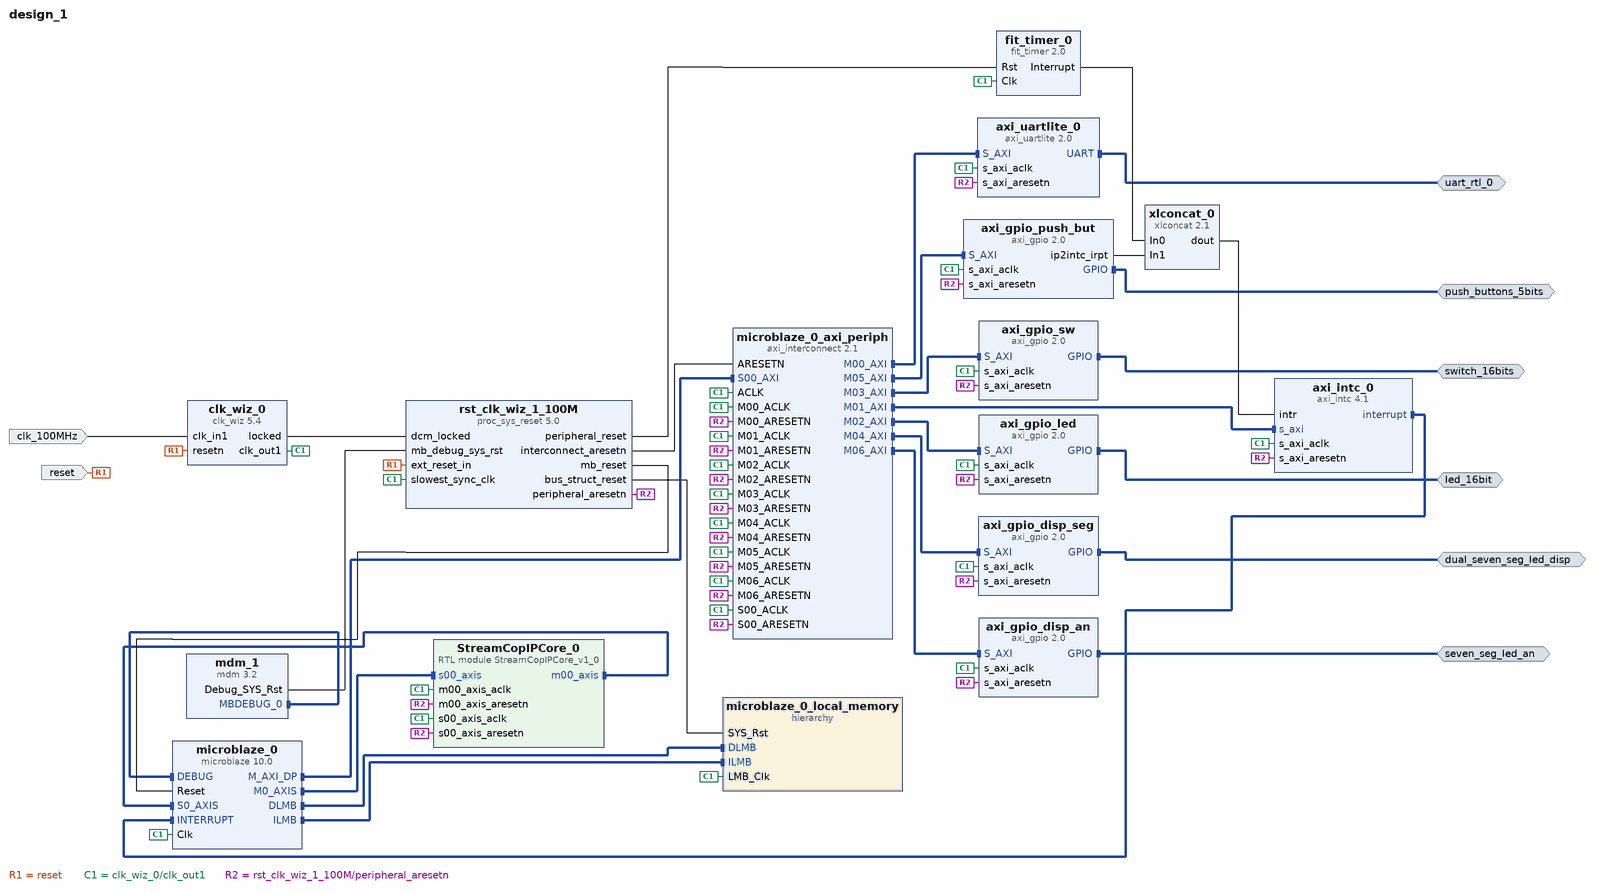
[diagram p0: block diagram of the top level]
# Vivado block design design_1, xc7a100tcsg324-1, Vivado 2017.4
create_bd_design design_1

create_bd_intf_port -mode Master -vlnv xilinx.com:interface:uart_rtl:1.0 uart_rtl_0
create_bd_intf_port -mode Master -vlnv xilinx.com:interface:gpio_rtl:1.0 led_16bit
create_bd_intf_port -mode Master -vlnv xilinx.com:interface:gpio_rtl:1.0 switch_16bits
create_bd_intf_port -mode Master -vlnv xilinx.com:interface:gpio_rtl:1.0 dual_seven_seg_led_disp
create_bd_intf_port -mode Master -vlnv xilinx.com:interface:gpio_rtl:1.0 push_buttons_5bits
create_bd_intf_port -mode Master -vlnv xilinx.com:interface:gpio_rtl:1.0 seven_seg_led_an
create_bd_port -dir I -type rst reset
set_property -dict {CONFIG.POLARITY ACTIVE_LOW} [get_bd_ports reset]
create_bd_port -dir I -type clk clk_100MHz
set_property -dict {CONFIG.FREQ_HZ 100000000} [get_bd_ports clk_100MHz]

create_bd_cell -type ip -vlnv xilinx.com:ip:microblaze:10.0 microblaze_0
set_property -dict [list \
  CONFIG.C_AREA_OPTIMIZED 0 \
  CONFIG.C_D_AXI 1 \
  CONFIG.C_D_LMB 1 \
  CONFIG.C_I_LMB 1 \
  CONFIG.C_ENABLE_DISCRETE_PORTS 0 \
  CONFIG.G_TEMPLATE_LIST 3 \
  CONFIG.G_USE_EXCEPTIONS 0 \
  CONFIG.C_USE_MSR_INSTR 0 \
  CONFIG.C_USE_PCMP_INSTR 0 \
  CONFIG.C_USE_REORDER_INSTR 1 \
  CONFIG.C_USE_BARREL 0 \
  CONFIG.C_USE_DIV 0 \
  CONFIG.C_USE_HW_MUL 0 \
  CONFIG.C_USE_FPU 0 \
  CONFIG.C_UNALIGNED_EXCEPTIONS 0 \
  CONFIG.C_ILL_OPCODE_EXCEPTION 0 \
  CONFIG.C_M_AXI_D_BUS_EXCEPTION 0 \
  CONFIG.C_PVR 0 \
  CONFIG.C_DEBUG_ENABLED 1 \
  CONFIG.C_NUMBER_OF_PC_BRK 1 \
  CONFIG.C_FSL_LINKS 1 \
  CONFIG.C_USE_ICACHE 0 \
  CONFIG.C_ADDR_TAG_BITS 0 \
  CONFIG.C_USE_DCACHE 0 \
  CONFIG.C_DCACHE_ADDR_TAG 0 \
  CONFIG.C_USE_MMU 0 \
  CONFIG.C_USE_BRANCH_TARGET_CACHE 0 \
] [get_bd_cells microblaze_0]
create_bd_cell -type hier microblaze_0_local_memory
create_bd_cell -type ip -vlnv xilinx.com:ip:axi_interconnect:2.1 microblaze_0_axi_periph
set_property -dict {CONFIG.NUM_MI 7} [get_bd_cells microblaze_0_axi_periph]
create_bd_cell -type ip -vlnv xilinx.com:ip:mdm:3.2 mdm_1
create_bd_cell -type ip -vlnv xilinx.com:ip:proc_sys_reset:5.0 rst_clk_wiz_1_100M
create_bd_cell -type ip -vlnv xilinx.com:ip:axi_uartlite:2.0 axi_uartlite_0
create_bd_cell -type ip -vlnv xilinx.com:ip:axi_intc:4.1 axi_intc_0
create_bd_cell -type ip -vlnv xilinx.com:ip:clk_wiz:5.4 clk_wiz_0
set_property -dict [list \
  CONFIG.CLKOUT1_REQUESTED_OUT_FREQ 50 \
  CONFIG.RESET_PORT resetn \
  CONFIG.MMCM_DIVCLK_DIVIDE 1 \
  CONFIG.MMCM_CLKFBOUT_MULT_F 10.000 \
  CONFIG.MMCM_CLKOUT0_DIVIDE_F 20.000 \
  CONFIG.RESET_TYPE ACTIVE_LOW \
  CONFIG.CLKOUT1_JITTER 151.636 \
  CONFIG.CLKOUT1_PHASE_ERROR 98.575 \
] [get_bd_cells clk_wiz_0]
create_bd_cell -type ip -vlnv xilinx.com:ip:axi_gpio:2.0 axi_gpio_led
set_property -dict {CONFIG.C_GPIO_WIDTH 16} [get_bd_cells axi_gpio_led]
create_bd_cell -type ip -vlnv xilinx.com:ip:axi_gpio:2.0 axi_gpio_sw
set_property -dict {CONFIG.C_GPIO_WIDTH 16} [get_bd_cells axi_gpio_sw]
create_bd_cell -type ip -vlnv xilinx.com:ip:axi_gpio:2.0 axi_gpio_disp_seg
set_property -dict {CONFIG.C_GPIO_WIDTH 8} [get_bd_cells axi_gpio_disp_seg]
create_bd_cell -type ip -vlnv xilinx.com:ip:axi_gpio:2.0 axi_gpio_push_but
set_property -dict {CONFIG.C_GPIO_WIDTH 5 CONFIG.C_INTERRUPT_PRESENT 1 CONFIG.C_ALL_OUTPUTS 0} [get_bd_cells axi_gpio_push_but]
create_bd_cell -type ip -vlnv xilinx.com:ip:axi_gpio:2.0 axi_gpio_disp_an
set_property -dict {CONFIG.C_GPIO_WIDTH 8} [get_bd_cells axi_gpio_disp_an]
create_bd_cell -type ip -vlnv xilinx.com:ip:xlconcat:2.1 xlconcat_0
create_bd_cell -type ip -vlnv xilinx.com:ip:fit_timer:2.0 fit_timer_0
create_bd_cell -type module -reference StreamCopIPCore_v1_0 StreamCopIPCore_0

# ---- hierarchy /microblaze_0_local_memory ----
current_bd_instance /microblaze_0_local_memory
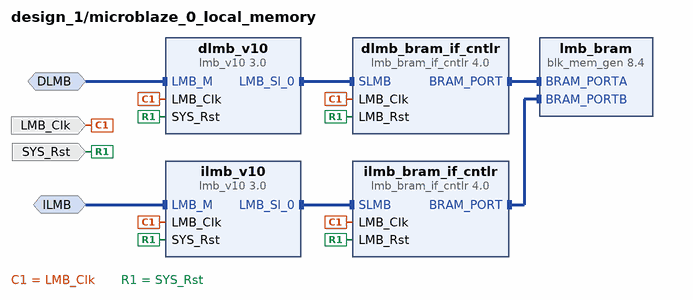
[diagram p1: block diagram inside /microblaze_0_local_memory]
create_bd_intf_pin -mode MirroredMaster -vlnv xilinx.com:interface:lmb_rtl:1.0 DLMB
create_bd_intf_pin -mode MirroredMaster -vlnv xilinx.com:interface:lmb_rtl:1.0 ILMB
create_bd_pin -dir I -type clk LMB_Clk
create_bd_pin -dir I -type rst SYS_Rst

create_bd_cell -type ip -vlnv xilinx.com:ip:lmb_v10:3.0 dlmb_v10
create_bd_cell -type ip -vlnv xilinx.com:ip:lmb_v10:3.0 ilmb_v10
create_bd_cell -type ip -vlnv xilinx.com:ip:lmb_bram_if_cntlr:4.0 dlmb_bram_if_cntlr
set_property -dict {CONFIG.C_ECC 0} [get_bd_cells dlmb_bram_if_cntlr]
create_bd_cell -type ip -vlnv xilinx.com:ip:lmb_bram_if_cntlr:4.0 ilmb_bram_if_cntlr
set_property -dict {CONFIG.C_ECC 0} [get_bd_cells ilmb_bram_if_cntlr]
create_bd_cell -type ip -vlnv xilinx.com:ip:blk_mem_gen:8.4 lmb_bram
set_property -dict {CONFIG.Memory_Type True_Dual_Port_RAM CONFIG.use_bram_block BRAM_Controller} [get_bd_cells lmb_bram]

# ---- connections ----

current_bd_instance /microblaze_0_local_memory
connect_bd_intf_net -intf_net microblaze_0_dlmb_bus [get_bd_intf_pins dlmb_v10/LMB_Sl_0] [get_bd_intf_pins dlmb_bram_if_cntlr/SLMB]
connect_bd_intf_net -intf_net microblaze_0_ilmb_bus [get_bd_intf_pins ilmb_v10/LMB_Sl_0] [get_bd_intf_pins ilmb_bram_if_cntlr/SLMB]
connect_bd_intf_net -intf_net microblaze_0_dlmb_cntlr [get_bd_intf_pins dlmb_bram_if_cntlr/BRAM_PORT] [get_bd_intf_pins lmb_bram/BRAM_PORTA]
connect_bd_intf_net -intf_net microblaze_0_ilmb_cntlr [get_bd_intf_pins ilmb_bram_if_cntlr/BRAM_PORT] [get_bd_intf_pins lmb_bram/BRAM_PORTB]
connect_bd_intf_net -intf_net microblaze_0_dlmb [get_bd_intf_pins DLMB] [get_bd_intf_pins dlmb_v10/LMB_M]
connect_bd_intf_net -intf_net microblaze_0_ilmb [get_bd_intf_pins ILMB] [get_bd_intf_pins ilmb_v10/LMB_M]
connect_bd_net -net microblaze_0_Clk [get_bd_pins LMB_Clk] \
  [get_bd_pins dlmb_v10/LMB_Clk] [get_bd_pins dlmb_bram_if_cntlr/LMB_Clk] [get_bd_pins ilmb_v10/LMB_Clk] \
  [get_bd_pins ilmb_bram_if_cntlr/LMB_Clk]
connect_bd_net [get_bd_pins SYS_Rst] \
  [get_bd_pins dlmb_v10/SYS_Rst] [get_bd_pins dlmb_bram_if_cntlr/LMB_Rst] [get_bd_pins ilmb_v10/SYS_Rst] \
  [get_bd_pins ilmb_bram_if_cntlr/LMB_Rst]

current_bd_instance /
connect_bd_intf_net [get_bd_intf_pins microblaze_0/DLMB] [get_bd_intf_pins microblaze_0_local_memory/DLMB]
connect_bd_intf_net [get_bd_intf_pins microblaze_0/ILMB] [get_bd_intf_pins microblaze_0_local_memory/ILMB]
connect_bd_intf_net -intf_net microblaze_0_axi_dp [get_bd_intf_pins microblaze_0_axi_periph/S00_AXI] [get_bd_intf_pins microblaze_0/M_AXI_DP]
connect_bd_intf_net [get_bd_intf_pins microblaze_0_axi_periph/M00_AXI] [get_bd_intf_pins axi_uartlite_0/S_AXI]
connect_bd_intf_net [get_bd_intf_pins microblaze_0_axi_periph/M01_AXI] [get_bd_intf_pins axi_intc_0/s_axi]
connect_bd_intf_net [get_bd_intf_pins microblaze_0/M0_AXIS] [get_bd_intf_pins StreamCopIPCore_0/s00_axis]
connect_bd_intf_net [get_bd_intf_pins StreamCopIPCore_0/m00_axis] [get_bd_intf_pins microblaze_0/S0_AXIS]
connect_bd_intf_net [get_bd_intf_pins axi_intc_0/interrupt] [get_bd_intf_pins microblaze_0/INTERRUPT]
connect_bd_intf_net [get_bd_intf_pins microblaze_0/DEBUG] [get_bd_intf_pins mdm_1/MBDEBUG_0]
connect_bd_intf_net [get_bd_intf_pins microblaze_0_axi_periph/M02_AXI] [get_bd_intf_pins axi_gpio_led/S_AXI]
connect_bd_intf_net [get_bd_intf_pins microblaze_0_axi_periph/M03_AXI] [get_bd_intf_pins axi_gpio_sw/S_AXI]
connect_bd_intf_net [get_bd_intf_pins microblaze_0_axi_periph/M04_AXI] [get_bd_intf_pins axi_gpio_disp_seg/S_AXI]
connect_bd_intf_net [get_bd_intf_pins microblaze_0_axi_periph/M05_AXI] [get_bd_intf_pins axi_gpio_push_but/S_AXI]
connect_bd_intf_net [get_bd_intf_pins microblaze_0_axi_periph/M06_AXI] [get_bd_intf_pins axi_gpio_disp_an/S_AXI]
connect_bd_intf_net [get_bd_intf_ports uart_rtl_0] [get_bd_intf_pins axi_uartlite_0/UART]
connect_bd_intf_net -intf_net axi_gpio_0_GPIO [get_bd_intf_ports led_16bit] [get_bd_intf_pins axi_gpio_led/GPIO]
connect_bd_intf_net -intf_net axi_gpio_1_GPIO [get_bd_intf_ports switch_16bits] [get_bd_intf_pins axi_gpio_sw/GPIO]
connect_bd_intf_net [get_bd_intf_ports dual_seven_seg_led_disp] [get_bd_intf_pins axi_gpio_disp_seg/GPIO]
connect_bd_intf_net [get_bd_intf_ports push_buttons_5bits] [get_bd_intf_pins axi_gpio_push_but/GPIO]
connect_bd_intf_net [get_bd_intf_ports seven_seg_led_an] [get_bd_intf_pins axi_gpio_disp_an/GPIO]
connect_bd_net [get_bd_pins rst_clk_wiz_1_100M/bus_struct_reset] [get_bd_pins microblaze_0_local_memory/SYS_Rst]
connect_bd_net [get_bd_pins rst_clk_wiz_1_100M/interconnect_aresetn] [get_bd_pins microblaze_0_axi_periph/ARESETN]
connect_bd_net [get_bd_pins mdm_1/Debug_SYS_Rst] [get_bd_pins rst_clk_wiz_1_100M/mb_debug_sys_rst]
connect_bd_net -net reset_rtl_0_0_1 [get_bd_ports reset] [get_bd_pins rst_clk_wiz_1_100M/ext_reset_in] [get_bd_pins clk_wiz_0/resetn]
connect_bd_net [get_bd_pins rst_clk_wiz_1_100M/mb_reset] [get_bd_pins microblaze_0/Reset]
connect_bd_net [get_bd_pins clk_wiz_0/locked] [get_bd_pins rst_clk_wiz_1_100M/dcm_locked]
connect_bd_net [get_bd_ports clk_100MHz] [get_bd_pins clk_wiz_0/clk_in1]
connect_bd_net [get_bd_pins clk_wiz_0/clk_out1] \
  [get_bd_pins microblaze_0/Clk] [get_bd_pins rst_clk_wiz_1_100M/slowest_sync_clk] [get_bd_pins axi_uartlite_0/s_axi_aclk] \
  [get_bd_pins axi_intc_0/s_axi_aclk] [get_bd_pins axi_gpio_led/s_axi_aclk] [get_bd_pins axi_gpio_sw/s_axi_aclk] \
  [get_bd_pins axi_gpio_disp_seg/s_axi_aclk] [get_bd_pins axi_gpio_push_but/s_axi_aclk] \
  [get_bd_pins axi_gpio_disp_an/s_axi_aclk] [get_bd_pins fit_timer_0/Clk] [get_bd_pins microblaze_0_local_memory/LMB_Clk] \
  [get_bd_pins microblaze_0_axi_periph/S00_ACLK] [get_bd_pins microblaze_0_axi_periph/ACLK] \
  [get_bd_pins microblaze_0_axi_periph/M00_ACLK] [get_bd_pins microblaze_0_axi_periph/M01_ACLK] \
  [get_bd_pins microblaze_0_axi_periph/M02_ACLK] [get_bd_pins microblaze_0_axi_periph/M03_ACLK] \
  [get_bd_pins microblaze_0_axi_periph/M04_ACLK] [get_bd_pins microblaze_0_axi_periph/M05_ACLK] \
  [get_bd_pins microblaze_0_axi_periph/M06_ACLK] [get_bd_pins StreamCopIPCore_0/m00_axis_aclk] \
  [get_bd_pins StreamCopIPCore_0/s00_axis_aclk]
connect_bd_net [get_bd_pins rst_clk_wiz_1_100M/peripheral_aresetn] \
  [get_bd_pins axi_uartlite_0/s_axi_aresetn] [get_bd_pins axi_intc_0/s_axi_aresetn] [get_bd_pins axi_gpio_led/s_axi_aresetn] \
  [get_bd_pins axi_gpio_sw/s_axi_aresetn] [get_bd_pins axi_gpio_disp_seg/s_axi_aresetn] \
  [get_bd_pins axi_gpio_push_but/s_axi_aresetn] [get_bd_pins axi_gpio_disp_an/s_axi_aresetn] \
  [get_bd_pins microblaze_0_axi_periph/S00_ARESETN] [get_bd_pins microblaze_0_axi_periph/M00_ARESETN] \
  [get_bd_pins microblaze_0_axi_periph/M01_ARESETN] [get_bd_pins microblaze_0_axi_periph/M02_ARESETN] \
  [get_bd_pins microblaze_0_axi_periph/M03_ARESETN] [get_bd_pins microblaze_0_axi_periph/M04_ARESETN] \
  [get_bd_pins microblaze_0_axi_periph/M05_ARESETN] [get_bd_pins microblaze_0_axi_periph/M06_ARESETN] \
  [get_bd_pins StreamCopIPCore_0/m00_axis_aresetn] [get_bd_pins StreamCopIPCore_0/s00_axis_aresetn]
connect_bd_net [get_bd_pins xlconcat_0/dout] [get_bd_pins axi_intc_0/intr]
connect_bd_net [get_bd_pins axi_gpio_push_but/ip2intc_irpt] [get_bd_pins xlconcat_0/In1]
connect_bd_net [get_bd_pins fit_timer_0/Interrupt] [get_bd_pins xlconcat_0/In0]
connect_bd_net [get_bd_pins rst_clk_wiz_1_100M/peripheral_reset] [get_bd_pins fit_timer_0/Rst]

# ---- address map ----
assign_bd_address -offset 0x00000000 -range 32K -target_address_space [get_bd_addr_spaces microblaze_0/Data] [get_bd_addr_segs microblaze_0_local_memory/dlmb_bram_if_cntlr/SLMB/Mem]
assign_bd_address -offset 0x40000000 -range 64K -target_address_space [get_bd_addr_spaces microblaze_0/Data] [get_bd_addr_segs axi_gpio_led/S_AXI/Reg]
assign_bd_address -offset 0x40010000 -range 64K -target_address_space [get_bd_addr_spaces microblaze_0/Data] [get_bd_addr_segs axi_gpio_sw/S_AXI/Reg]
assign_bd_address -offset 0x40020000 -range 64K -target_address_space [get_bd_addr_spaces microblaze_0/Data] [get_bd_addr_segs axi_gpio_disp_seg/S_AXI/Reg]
assign_bd_address -offset 0x40030000 -range 64K -target_address_space [get_bd_addr_spaces microblaze_0/Data] [get_bd_addr_segs axi_gpio_push_but/S_AXI/Reg]
assign_bd_address -offset 0x40040000 -range 64K -target_address_space [get_bd_addr_spaces microblaze_0/Data] [get_bd_addr_segs axi_gpio_disp_an/S_AXI/Reg]
assign_bd_address -offset 0x40600000 -range 64K -target_address_space [get_bd_addr_spaces microblaze_0/Data] [get_bd_addr_segs axi_uartlite_0/S_AXI/Reg]
assign_bd_address -offset 0x41200000 -range 64K -target_address_space [get_bd_addr_spaces microblaze_0/Data] [get_bd_addr_segs axi_intc_0/S_AXI/Reg]
assign_bd_address -offset 0x00000000 -range 32K -target_address_space [get_bd_addr_spaces microblaze_0/Instruction] [get_bd_addr_segs microblaze_0_local_memory/ilmb_bram_if_cntlr/SLMB/Mem]

validate_bd_design
save_bd_design
